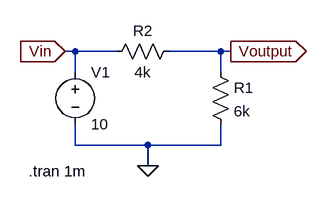
[diagram p0: schematic Draft1.asc]
Draft1.asc, the LTspice schematic file:
Version 4
SHEET 1 880 680
WIRE -48 64 -64 64
WIRE 16 64 -48 64
WIRE 176 64 96 64
WIRE 192 64 176 64
WIRE -48 96 -48 64
WIRE 176 96 176 64
WIRE -48 208 -48 176
WIRE 64 208 -48 208
WIRE 176 208 176 176
WIRE 176 208 64 208
WIRE 64 240 64 208
FLAG -64 64 Vin
IOPIN -64 64 In
FLAG 192 64 Voutput
IOPIN 192 64 Out
FLAG 64 240 0
SYMBOL voltage -48 80 R0
WINDOW 123 0 0 Left 0
WINDOW 39 0 0 Left 0
SYMATTR InstName V1
SYMATTR Value 10
SYMBOL res 160 80 R0
SYMATTR InstName R1
SYMATTR Value 6k
SYMBOL res 112 48 R90
WINDOW 0 0 56 VBottom 2
WINDOW 3 32 56 VTop 2
SYMATTR InstName R2
SYMATTR Value 4k
TEXT -120 248 Left 2 !.tran 1m

The netlist it stands for:
* Draft1.asc
V1 Vin 0 10
R1 Voutput 0 6k
R2 Voutput Vin 4k
.tran 1m
.backanno
.end